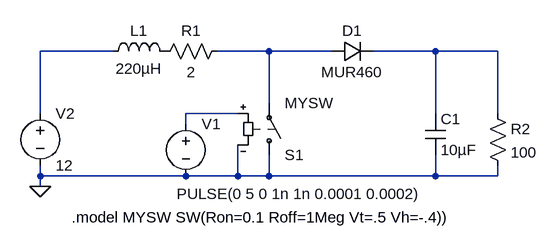
[diagram p0: schematic sim2.asc]
sim2.asc, the LTspice schematic file:
Version 4
SHEET 1 880 680
WIRE -64 64 -176 64
WIRE 176 64 96 64
WIRE 272 64 176 64
WIRE 432 64 336 64
WIRE 528 64 432 64
WIRE 176 144 176 64
WIRE -176 160 -176 64
WIRE 128 160 48 160
WIRE 432 160 432 64
WIRE 528 160 528 64
WIRE 48 176 48 160
WIRE -176 256 -176 240
WIRE 48 256 -176 256
WIRE 128 256 128 208
WIRE 128 256 48 256
WIRE 176 256 176 224
WIRE 176 256 128 256
WIRE 432 256 432 224
WIRE 432 256 176 256
WIRE 528 256 528 240
WIRE 528 256 432 256
WIRE -176 272 -176 256
FLAG -176 272 0
SYMBOL voltage 48 160 R0
WINDOW 3 -14 124 Left 2
WINDOW 123 0 0 Left 2
WINDOW 39 24 124 Left 2
SYMATTR InstName V1
SYMATTR Value PULSE(0 5 0 1n 1n 0.0001 0.0002)
SYMBOL voltage -176 144 R0
WINDOW 123 0 0 Left 2
WINDOW 39 0 0 Left 2
SYMATTR InstName V2
SYMATTR Value 12
SYMBOL sw 176 240 M180
SYMATTR InstName S1
SYMATTR Value MYSW
SYMBOL res 0 80 R270
WINDOW 0 32 56 VTop 2
WINDOW 3 0 56 VBottom 2
SYMATTR InstName R1
SYMATTR Value 2
SYMBOL res 512 144 R0
SYMATTR InstName R2
SYMATTR Value 100
SYMBOL cap 416 160 R0
SYMATTR InstName C1
SYMATTR Value 10µF
SYMBOL ind -80 80 R270
WINDOW 0 32 56 VTop 2
WINDOW 3 5 56 VBottom 2
SYMATTR InstName L1
SYMATTR Value 220µH
SYMBOL diode 272 80 R270
WINDOW 0 32 32 VTop 2
WINDOW 3 0 32 VBottom 2
SYMATTR InstName D1
SYMATTR Value MUR460
TEXT -128 320 Left 2 !.model MYSW SW(Ron=0.1 Roff=1Meg Vt=.5 Vh=-.4))

The netlist it stands for:
* sim2.asc
V1 N004 0 PULSE(0 5 0 1n 1n 0.0001 0.0002)
V2 N001 0 12
S1 0 N002 N004 0 MYSW
R1 P001 N002 2
R2 N003 0 100
C1 N003 0 10µF
L1 N001 P001 220µH
D1 N002 N003 MUR460
.model D D
.lib standard.dio
.model MYSW SW(Ron=0.1 Roff=1Meg Vt=.5 Vh=-.4))
.backanno
.end